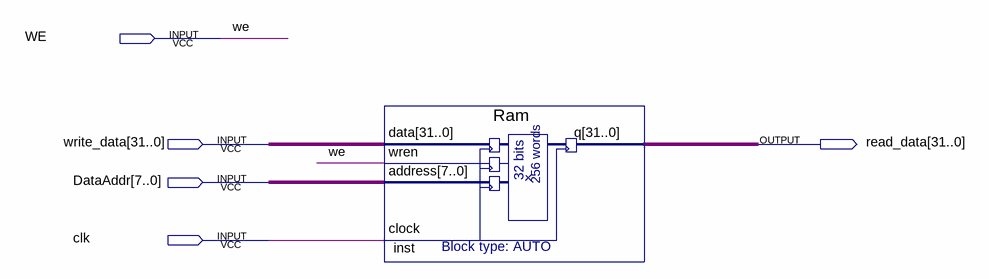
[diagram p0: schematic sheet]
// Quartus schematic RAM_Data.bdf as structural Verilog: 1 symbols, 5 pins
module RAM_Data (
  input  WE,
  input  [31:0] write_data,
  input  [7:0] DataAddr,
  input  clk,
  output [31:0] read_data
);

  Ram inst (.data(write_data), .wren(WE), .address(DataAddr), .clock(clk), .q(read_data));
endmodule
